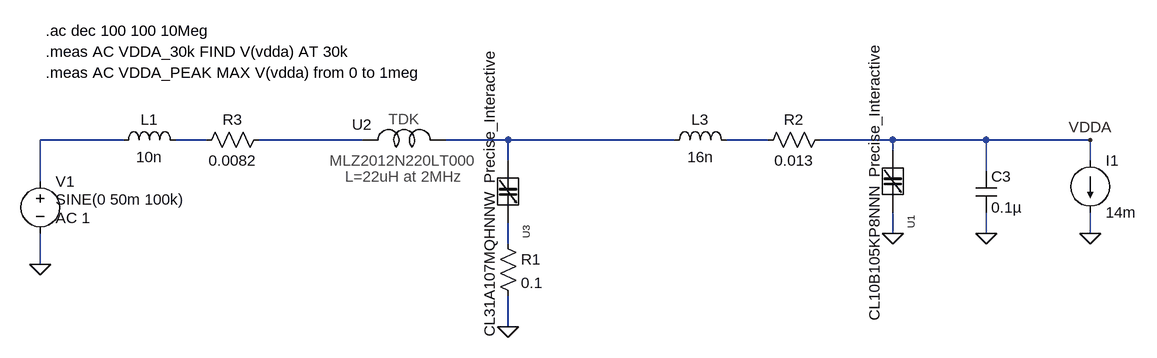
[diagram p0: schematic vdda_filter.asc]
vdda_filter.asc, the LTspice schematic file:
Version 4
SHEET 1 1840 680
WIRE 272 32 144 32
WIRE 400 32 352 32
WIRE 640 32 480 32
WIRE 864 32 768 32
WIRE 1120 32 864 32
WIRE 1264 32 1200 32
WIRE 1456 32 1344 32
WIRE 1600 32 1456 32
WIRE 1760 32 1600 32
WIRE 1456 48 1456 32
WIRE 864 64 864 32
WIRE 1760 64 1760 32
WIRE 1600 80 1600 32
WIRE 144 96 144 32
WIRE 1456 176 1456 144
WIRE 1600 176 1600 144
WIRE 1760 176 1760 144
WIRE 864 192 864 160
WIRE 144 224 144 176
WIRE 864 320 864 272
FLAG 144 224 0
FLAG 864 320 0
FLAG 1456 176 0
FLAG 1600 176 0
FLAG 1760 176 0
FLAG 1760 32 VDDA
SYMBOL voltage 144 80 R0
WINDOW 3 24 44 Left 2
WINDOW 123 24 72 Left 2
WINDOW 39 0 0 Left 0
SYMATTR InstName V1
SYMATTR Value SINE(0 50m 100k)
SYMATTR Value2 AC 1
SYMBOL ind 256 48 R270
WINDOW 0 32 56 VTop 2
WINDOW 3 5 56 VBottom 2
SYMATTR InstName L1
SYMATTR Value 10n
SYMATTR SpiceLine Rser=0 Rpar=0 Cpar=0
SYMBOL res 848 176 R0
SYMATTR InstName R1
SYMATTR Value 0.1
SYMBOL ind 1104 48 R270
WINDOW 0 32 56 VTop 2
WINDOW 3 5 56 VBottom 2
SYMATTR InstName L3
SYMATTR Value 16n
SYMATTR SpiceLine Rser=0 Rpar=0 Cpar=0
SYMBOL res 1360 16 R90
WINDOW 0 0 56 VBottom 2
WINDOW 3 32 56 VTop 2
SYMATTR InstName R2
SYMATTR Value 0.013
SYMBOL cap 1584 80 R0
SYMATTR InstName C3
SYMATTR Value 0.1µ
SYMATTR SpiceLine Irms=0 Rser=0 Lser=0 Rpar=0 Cpar=0
SYMBOL current 1760 64 R0
WINDOW 123 0 0 Left 0
WINDOW 39 0 0 Left 0
SYMATTR InstName I1
SYMATTR Value 14m
SYMBOL res 496 16 R90
WINDOW 0 0 56 VBottom 2
WINDOW 3 32 56 VTop 2
SYMATTR InstName R3
SYMATTR Value 0.0082
SYMBOL CL10B105KP8NNN_Precise_Interactive_LT 1456 96 R90
SYMATTR InstName U1
SYMBOL MLZ2012N220LT000_b 704 32 R0
SYMATTR InstName U2
SYMBOL CL31A107MQHNNW_Precise_Interactive_LT 864 112 R90
SYMATTR InstName U3
TEXT 152 -136 Left 2 !.ac dec 100 100 10Meg
TEXT 152 -72 Left 2 !.meas AC VDDA_PEAK MAX V(vdda) from 0 to 1meg
TEXT 152 -104 Left 2 !.meas AC VDDA_30k FIND V(vdda) AT 30k

The netlist it stands for:
* vdda_filter.asc
V1 N001 0 SINE(0 50m 100k) AC 1
L1 N001 N002 10n Rser=0 Rpar=0 Cpar=0
R1 N006 0 0.1
L3 N004 N005 16n Rser=0 Rpar=0 Cpar=0
R2 VDDA N005 0.013
C3 VDDA 0 0.1µ Irms=0 Rser=0 Lser=0 Rpar=0 Cpar=0
I1 VDDA 0 14m
R3 N003 N002 0.0082
XU1 0 VDDA CL10B105KP8NNN_Precise_Interactive  ; pins A B
XU2 N003 N004 MLZ2012N220LT000_b  ; pins 1 2
XU3 N006 N004 CL31A107MQHNNW_Precise_Interactive  ; pins A B
.ac dec 100 100 10Meg
.meas AC VDDA_PEAK MAX V(vdda) from 0 to 1meg
.meas AC VDDA_30k FIND V(vdda) AT 30k
.lib CL10B105KP8NNN_Precise_Interactive_LT.mod
.lib MLZ2012N220LT000_b_LTspice.mod
.lib CL31A107MQHNNW_Precise_Interactive_LT.mod
.backanno
.end